# Altium schematic sheet [1]-MCU.SchDoc
size A4
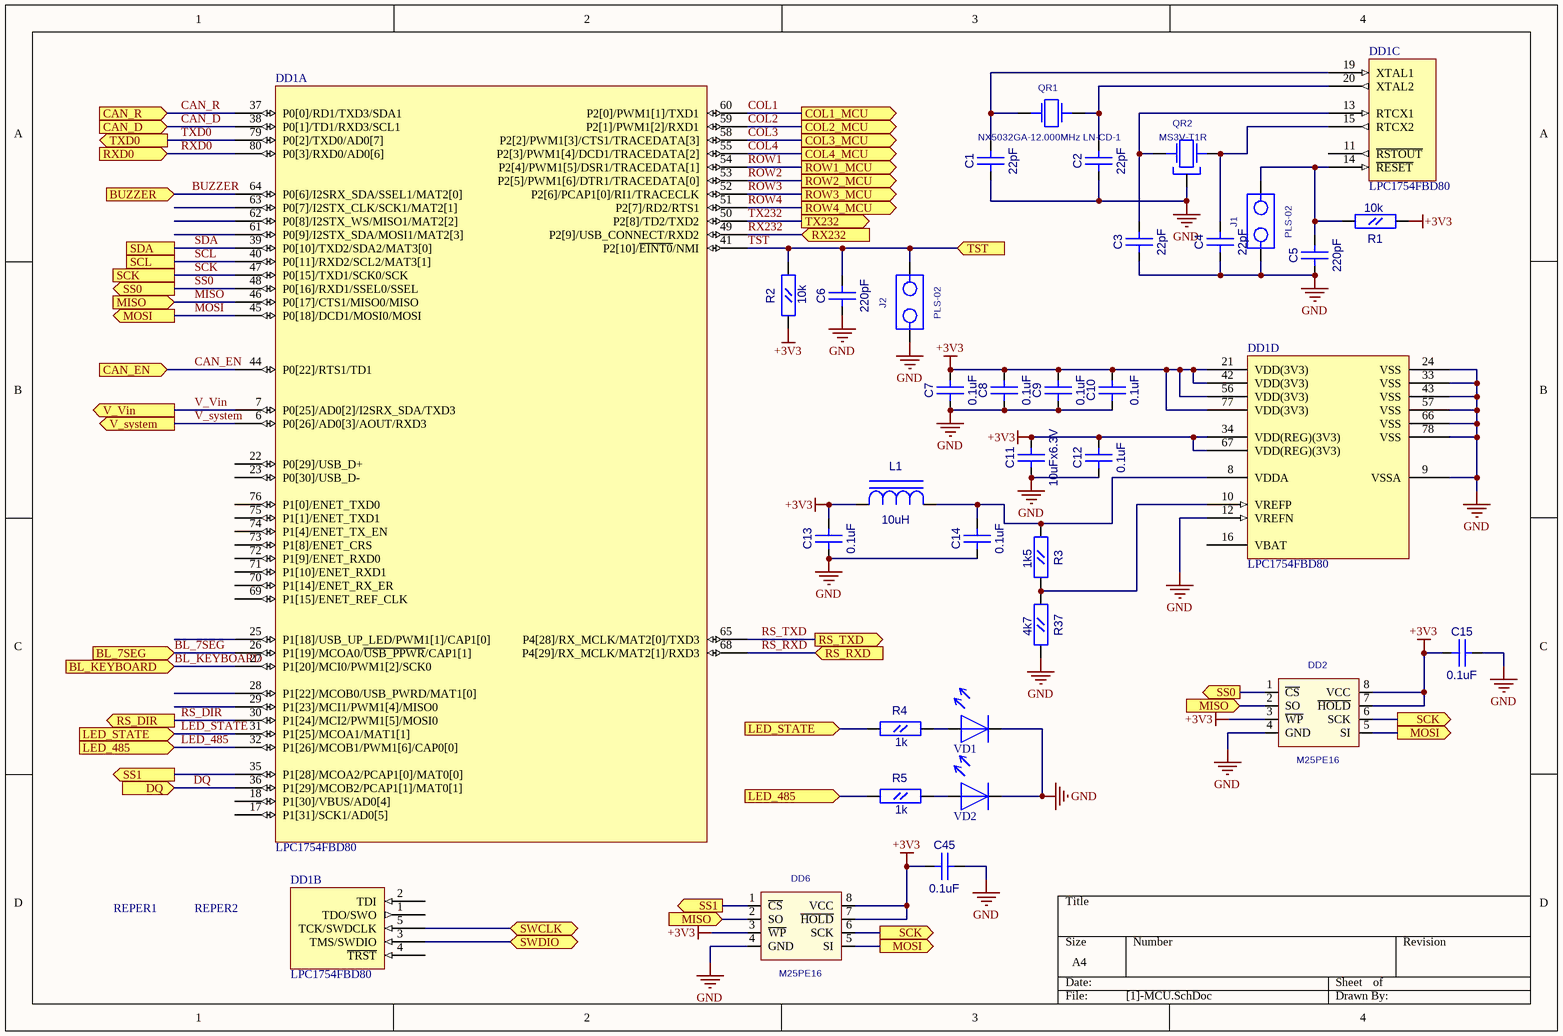
[diagram p0: [1]-MCU.SchDoc]

## Parts
C1  22pF  [CC0603]
C2  22pF  [CC0603]
C3  22pF  [CC0603]
C4  22pF  [CC0603]
C5  220pF  [CC0603]
C6  220pF  [CC0603]
C7  0.1uF  [CC0603]
C8  0.1uF  [CC0603]
C9  0.1uF  [CC0603]
C10  0.1uF  [CC0603]
C11  10uFx6.3V  [CC0805]
C12  0.1uF  [CC0603]
C13  0.1uF  [CC0603]
C14  0.1uF  [CC0603]
C15  0.1uF  [CC0603]
C45  0.1uF  [CC0603]
DD1  LPC1754FBD80  [TQFP-80_0.5]  (parts A,B,C,D of 4)
DD2  M25PE16  [EIAJ_SO8]
DD6  M25PE16  [EIAJ_SO8]
J1  PLS-02  [PLS-02]
J2  PLS-02  [PLS-02]
L1  10uH  [L0603]
QR1  NX5032GA-12.000MHz LN-CD-1  [AC5032_2]
QR2  MS3V-T1R  [MS3V-T1R]
R1  10k  [RC0603]
R2  10k  [RC0603]
R3  1k5  [RC0603]
R4  1k  [RC0603]
R5  1k  [RC0603]
R37  4k7  [RC0603]
REPER1  REPER1.2  [REPER1.2]  (value not drawn)
REPER2  REPER1.2  [REPER1.2]  (value not drawn)
VD1  LED_0805  [LED0805]  (value not drawn)
VD2  LED_0805  [LED0805]  (value not drawn)

## Ports
BL_7SEG (in), BL_KEYBOARD (in), BUZZER (in), CAN_D (in), CAN_EN (in), CAN_R (in), COL1_MCU (out), COL2_MCU (out), COL3_MCU (out), COL4_MCU (out), DQ (in), LED_485 (in), LED_STATE (in), MISO (in), MOSI (out), ROW1_MCU (out), ROW2_MCU (out), ROW3_MCU (out), ROW4_MCU (out), RS_DIR (out), RS_RXD (in), RS_TXD (out), RX232 (in), RXD0 (in), SCK, SCK (out), SCL, SDA, SS0 (out), SS1 (out), SWCLK (bidir), SWDIO (bidir), TST (in), TX232 (out), TXD0 (out), V_system (out), V_Vin (out)

## Nets
+3V3: C7.2(B) C8.2(B) C9.2(B) C10.2(B) C11.2(B) C12.2(B) C13.2(B) C15.1(A) C45.1(A) DD1.21(VDD(3V3)) DD1.34(VDD(REG)(3V3)) DD1.42(VDD(3V3)) DD1.56(VDD(3V3)) DD1.67(VDD(REG)(3V3)) DD1.77(VDD(3V3)) DD2.3(~{WP}) DD2.7(~{HOLD}) DD2.8(VCC) DD6.3(~{WP}) DD6.7(~{HOLD}) DD6.8(VCC) L1.1(A) R1.1(A) R2.1(A)
GND: C1.1(A) C2.1(A) C3.1(A) C4.1(A) C5.1(A) C6.1(A) C7.1(A) C8.1(A) C9.1(A) C10.1(A) C11.1(A) C12.1(A) C13.1(A) C14.1(A) C15.2(B) C45.2(B) DD1.9(VSSA) DD1.12(VREFN) DD1.24(VSS) DD1.33(VSS) DD1.43(VSS) DD1.57(VSS) DD1.66(VSS) DD1.78(VSS) DD2.4(GND) DD6.4(GND) J1.1 J2.1 QR2.3 R37.2(B) VD1.2 VD2.2
BL_7SEG: DD1.26(P1[19]/MCOA0/~{USB_PPWR}/CAP1[1]) ; port BL_7SEG
BL_KEYBOARD: DD1.27(P1[20]/MCI0/PWM1[2]/SCK0) ; port BL_KEYBOARD
BUZZER: DD1.64(P0[6]/I2SRX_SDA/SSEL1/MAT2[0]) ; port BUZZER
CAN_D: DD1.38(P0[1]/TD1/RXD3/SCL1) ; port CAN_D
CAN_EN: DD1.44(P0[22]/RTS1/TD1) ; port CAN_EN
CAN_R: DD1.37(P0[0]/RD1/TXD3/SDA1) ; port CAN_R
COL1: DD1.60(P2[0]/PWM1[1]/TXD1) ; port COL1_MCU
COL2: DD1.59(P2[1]/PWM1[2]/RXD1) ; port COL2_MCU
COL3: DD1.58(P2[2]/PWM1[3]/CTS1/TRACEDATA[3]) ; port COL3_MCU
COL4: DD1.55(P2[3]/PWM1[4]/DCD1/TRACEDATA[2]) ; port COL4_MCU
DQ: DD1.36(P1[29]/MCOB2/PCAP1[1]/MAT0[1]) ; port DQ
LED_485: DD1.32(P1[26]/MCOB1/PWM1[6]/CAP0[0]) R5.1(A) ; port LED_485
LED_STATE: DD1.31(P1[25]/MCOA1/MAT1[1]) R4.1(A) ; port LED_STATE
MISO: DD1.46(P0[17]/CTS1/MISO0/MISO) DD2.2(SO) DD6.2(SO) ; port MISO
MOSI: DD1.45(P0[18]/DCD1/MOSI0/MOSI) DD2.5(SI) DD6.5(SI) ; port MOSI
ROW1: DD1.54(P2[4]/PWM1[5]/DSR1/TRACEDATA[1]) ; port ROW1_MCU
ROW2: DD1.53(P2[5]/PWM1[6]/DTR1/TRACEDATA[0]) ; port ROW2_MCU
ROW3: DD1.52(P2[6]/PCAP1[0]/RI1/TRACECLK) ; port ROW3_MCU
ROW4: DD1.51(P2[7]/RD2/RTS1) ; port ROW4_MCU
RS_DIR: DD1.30(P1[24]/MCI2/PWM1[5]/MOSI0) ; port RS_DIR
RS_RXD: DD1.68(P4[29]/RX_MCLK/MAT2[1]/RXD3) ; port RS_RXD
RS_TXD: DD1.65(P4[28]/RX_MCLK/MAT2[0]/TXD3) ; port RS_TXD
RX232: DD1.49(P2[9]/USB_CONNECT/RXD2) ; port RX232
RXD0: DD1.80(P0[3]/RXD0/AD0[6]) ; port RXD0
SCK: DD1.47(P0[15]/TXD1/SCK0/SCK) DD2.6(SCK) DD6.6(SCK) ; port SCK
SCL: DD1.40(P0[11]/RXD2/SCL2/MAT3[1]) ; port SCL
SDA: DD1.39(P0[10]/TXD2/SDA2/MAT3[0]) ; port SDA
SS0: DD1.48(P0[16]/RXD1/SSEL0/SSEL) DD2.1(~{CS}) ; port SS0
SS1: DD1.35(P1[28]/MCOA2/PCAP1[0]/MAT0[0]) DD6.1(~{CS}) ; port SS1
SWCLK: DD1.5(TCK/SWDCLK) ; port SWCLK
SWDIO: DD1.3(TMS/SWDIO) ; port SWDIO
TST: C6.2(B) DD1.41(P2[10]/~{EINT0}/NMI) J2.2 R2.2(B) ; port TST
TX232: DD1.50(P2[8]/TD2/TXD2) ; port TX232
TXD0: DD1.79(P0[2]/TXD0/AD0[7]) ; port TXD0
V_system: DD1.6(P0[26]/AD0[3]/AOUT/RXD3) ; port V_system
V_Vin: DD1.7(P0[25]/AD0[2]/I2SRX_SDA/TXD3) ; port V_Vin
NetC1_2: C1.2(B) DD1.19(XTAL1) QR1.1
NetC2_2: C2.2(B) DD1.20(XTAL2) QR1.2
NetC3_2: C3.2(B) DD1.13(RTCX1) QR2.2(X2)
NetC4_2: C4.2(B) DD1.15(RTCX2) QR2.1(X1)
NetC5_2: C5.2(B) DD1.14(~{RESET}) J1.2 R1.2(B)
NetC14_2: C14.2(B) DD1.8(VDDA) L1.2(C) R3.1(A)
NetDD1_10: DD1.10(VREFP) R3.2(B) R37.1(A)
NetR4_2: R4.2(B) VD1.1
NetR5_2: R5.2(B) VD2.1

Not connected (* = marked no-connect by the designer): DD1 1(TDO/SWO) 2(TDI) 4(~{TRST}) 11(~{RSTOUT}) 16(VBAT) 17(P1[31]/SCK1/AD0[5]) 18(P1[30]/VBUS/AD0[4]) 22(P0[29]/USB_D+) 23(P0[30]/USB_D-) 25(P1[18]/USB_UP_LED/PWM1[1]/CAP1[0]) 28(P1[22]/MCOB0/USB_PWRD/MAT1[0]) 29(P1[23]/MCI1/PWM1[4]/MISO0) 61(P0[9]/I2STX_SDA/MOSI1/MAT2[3]) 62(P0[8]/I2STX_WS/MISO1/MAT2[2]) 63(P0[7]/I2STX_CLK/SCK1/MAT2[1]) 69(P1[15]/ENET_REF_CLK) 70(P1[14]/ENET_RX_ER) 71(P1[10]/ENET_RXD1) 72(P1[9]/ENET_RXD0) 73(P1[8]/ENET_CRS) 74(P1[4]/ENET_TX_EN) 75(P1[1]/ENET_TXD1) 76(P1[0]/ENET_TXD0); REPER1 1; REPER2 1

## Library data of the parts
C1-C10 C12-C15 C45 = CC0603
  C1-C4: Value: 22pF
  C5 C6: Value: 220pF
  C7-C10 C12-C15 C45: Value: 0.1uF
C11 = CC0805: Value: 10uFx6.3V
DD1 = LPC1754FBD80: Cortex -M3 32-Bit Microcontroller, 128KB Flash, 64KB RAM, 800-Lead LQFP; ComponentLink1Description: Manufacturer Link; ComponentLink1URL: http://www.nxp.com/
DD2 DD6 = S25FL016A0LMFI01: Value: M25PE16
L1 = L0603: Value: 10uH
QR1 = AC5032_2: AC5032/2; Value: NX5032GA-12.000MHz LN-CD-1
QR2 = MS3V-T1R: CRYSTAL_32768 Hz; Value: *
R1-R5 R37 = RC0603
  R1 R2: Value: 10k
  R3: Value: 1k5
  R4 R5: Value: 1k
  R37: Value: 4k7
J1 J2 = PLS-02: Value: *
REPER1 REPER2 = REPER1.2: Value: *
VD1 VD2 = LED_0805: Value: LED_0805